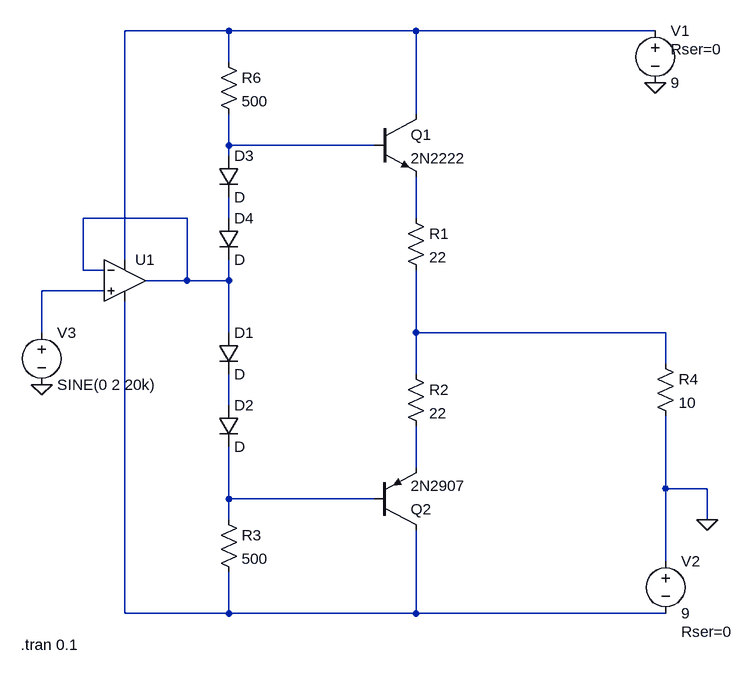
[diagram p0: schematic output_v1.asc]
output_v1.asc, the LTspice schematic file:
Version 4
SHEET 1 880 680
WIRE -336 -704 -496 -704
WIRE -48 -704 -336 -704
WIRE 320 -704 -48 -704
WIRE -336 -656 -336 -704
WIRE -48 -576 -48 -704
WIRE -336 -528 -336 -576
WIRE -112 -528 -336 -528
WIRE -336 -512 -336 -528
WIRE -400 -416 -560 -416
WIRE -336 -416 -336 -448
WIRE -48 -416 -48 -480
WIRE -496 -352 -496 -704
WIRE -560 -336 -560 -416
WIRE -528 -336 -560 -336
WIRE -400 -320 -400 -416
WIRE -400 -320 -464 -320
WIRE -336 -320 -336 -352
WIRE -336 -320 -400 -320
WIRE -528 -304 -624 -304
WIRE -624 -240 -624 -304
WIRE -336 -240 -336 -320
WIRE -48 -240 -48 -336
WIRE 336 -240 -48 -240
WIRE 336 -192 336 -240
WIRE -48 -176 -48 -240
WIRE -336 -128 -336 -176
WIRE -48 -32 -48 -96
WIRE 336 0 336 -112
WIRE 400 0 336 0
WIRE -336 16 -336 -64
WIRE -112 16 -336 16
WIRE -336 48 -336 16
WIRE 400 48 400 0
WIRE 336 112 336 0
WIRE -496 192 -496 -288
WIRE -336 192 -336 128
WIRE -336 192 -496 192
WIRE -48 192 -48 64
WIRE -48 192 -336 192
WIRE 336 192 -48 192
FLAG 320 -624 0
FLAG 400 48 0
FLAG -624 -160 0
SYMBOL npn -112 -576 R0
SYMATTR InstName Q1
SYMATTR Value 2N2222
SYMBOL res -64 -432 R0
SYMATTR InstName R1
SYMATTR Value 22
SYMATTR SpiceLine tol=1 pwr=0.1
SYMBOL res -64 -192 R0
SYMATTR InstName R2
SYMATTR Value 22
SYMATTR SpiceLine tol=1 pwr=0.1
SYMBOL diode -352 -240 R0
SYMATTR InstName D1
SYMBOL diode -352 -128 R0
SYMATTR InstName D2
SYMBOL res -352 32 R0
SYMATTR InstName R3
SYMATTR Value 500
SYMATTR SpiceLine tol=1 pwr=0.1
SYMBOL voltage 320 -720 R0
WINDOW 123 0 0 Left 0
WINDOW 39 24 44 Left 2
SYMATTR SpiceLine Rser=0
SYMATTR InstName V1
SYMATTR Value 9
SYMBOL voltage 336 96 R0
WINDOW 123 0 0 Left 0
WINDOW 39 24 124 Left 2
SYMATTR SpiceLine Rser=0
SYMATTR InstName V2
SYMATTR Value 9
SYMBOL voltage -624 -256 R0
WINDOW 123 0 0 Left 0
WINDOW 39 0 0 Left 0
SYMATTR InstName V3
SYMATTR Value SINE(0 2 20k)
SYMBOL diode -352 -512 R0
SYMATTR InstName D3
SYMBOL diode -352 -416 R0
SYMATTR InstName D4
SYMBOL res -352 -672 R0
SYMATTR InstName R6
SYMATTR Value 500
SYMBOL res 320 -208 R0
SYMATTR InstName R4
SYMATTR Value 10
SYMBOL pnp -112 64 M180
SYMATTR InstName Q2
SYMATTR Value 2N2907
SYMBOL OpAmps\\UniversalOpAmp -496 -320 R0
SYMATTR InstName U1
TEXT -656 240 Left 2 !.tran 0.1

The netlist it stands for:
* output_v1.asc
Q1 N001 N002 N005 0 2N2222
R1 N005 N007 22 tol=1 pwr=0.1
R2 N007 N009 22 tol=1 pwr=0.1
D1 N003 N008 D
D2 N008 N010 D
R3 N010 N011 500 tol=1 pwr=0.1
V1 N001 0 9 Rser=0
V2 0 N011 9 Rser=0
V3 N006 0 SINE(0 2 20k)
D3 N002 N004 D
D4 N004 N003 D
R6 N001 N002 500
R4 N007 0 10
Q2 N011 N010 N009 0 2N2907
XU1 N006 N003 N001 N011 N003 level1 Avol=1Meg GBW=10Meg Vos=0 En=0 Enk=0 In=0 Ink=0 Rin=500Meg  ; pins In+ In- V+ V- OUT
.model D D
.lib standard.dio
.model NPN NPN
.model PNP PNP
.lib standard.bjt
.tran 0.1
.lib UniversalOpAmp1.lib
.backanno
.end